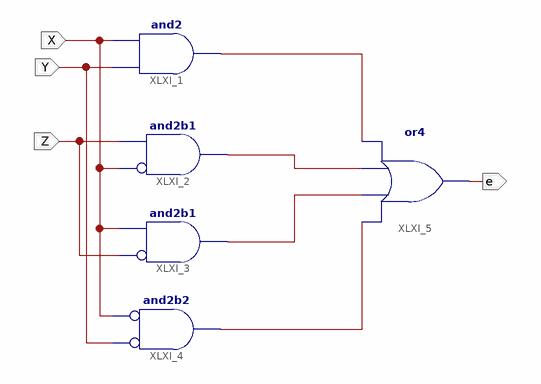
[diagram p0: schematic sheet 1]
// Xilinx ISE schematic circuitoE.sch (spartan3e) as structural Verilog: 5 symbols, 4 ports
module circuitoE (
  input  X,
  input  Y,
  input  Z,
  output e
);

  wire XLXN_1, XLXN_2, XLXN_3, XLXN_4;

  and XLXI_1 (XLXN_1, Y, X);
  and XLXI_2 (XLXN_2, ~X, Z);  // and2b1
  and XLXI_3 (XLXN_3, ~Z, X);  // and2b1
  and XLXI_4 (XLXN_4, ~Y, ~X);  // and2b2
  or XLXI_5 (e, XLXN_4, XLXN_3, XLXN_2, XLXN_1);
endmodule
